# EAGLE design WRIST Sensors (EAGLE 9.6.2)
COMPANY: ADAFRUIT INDUSTRIES; DRAWN: KTOWN; REV: A
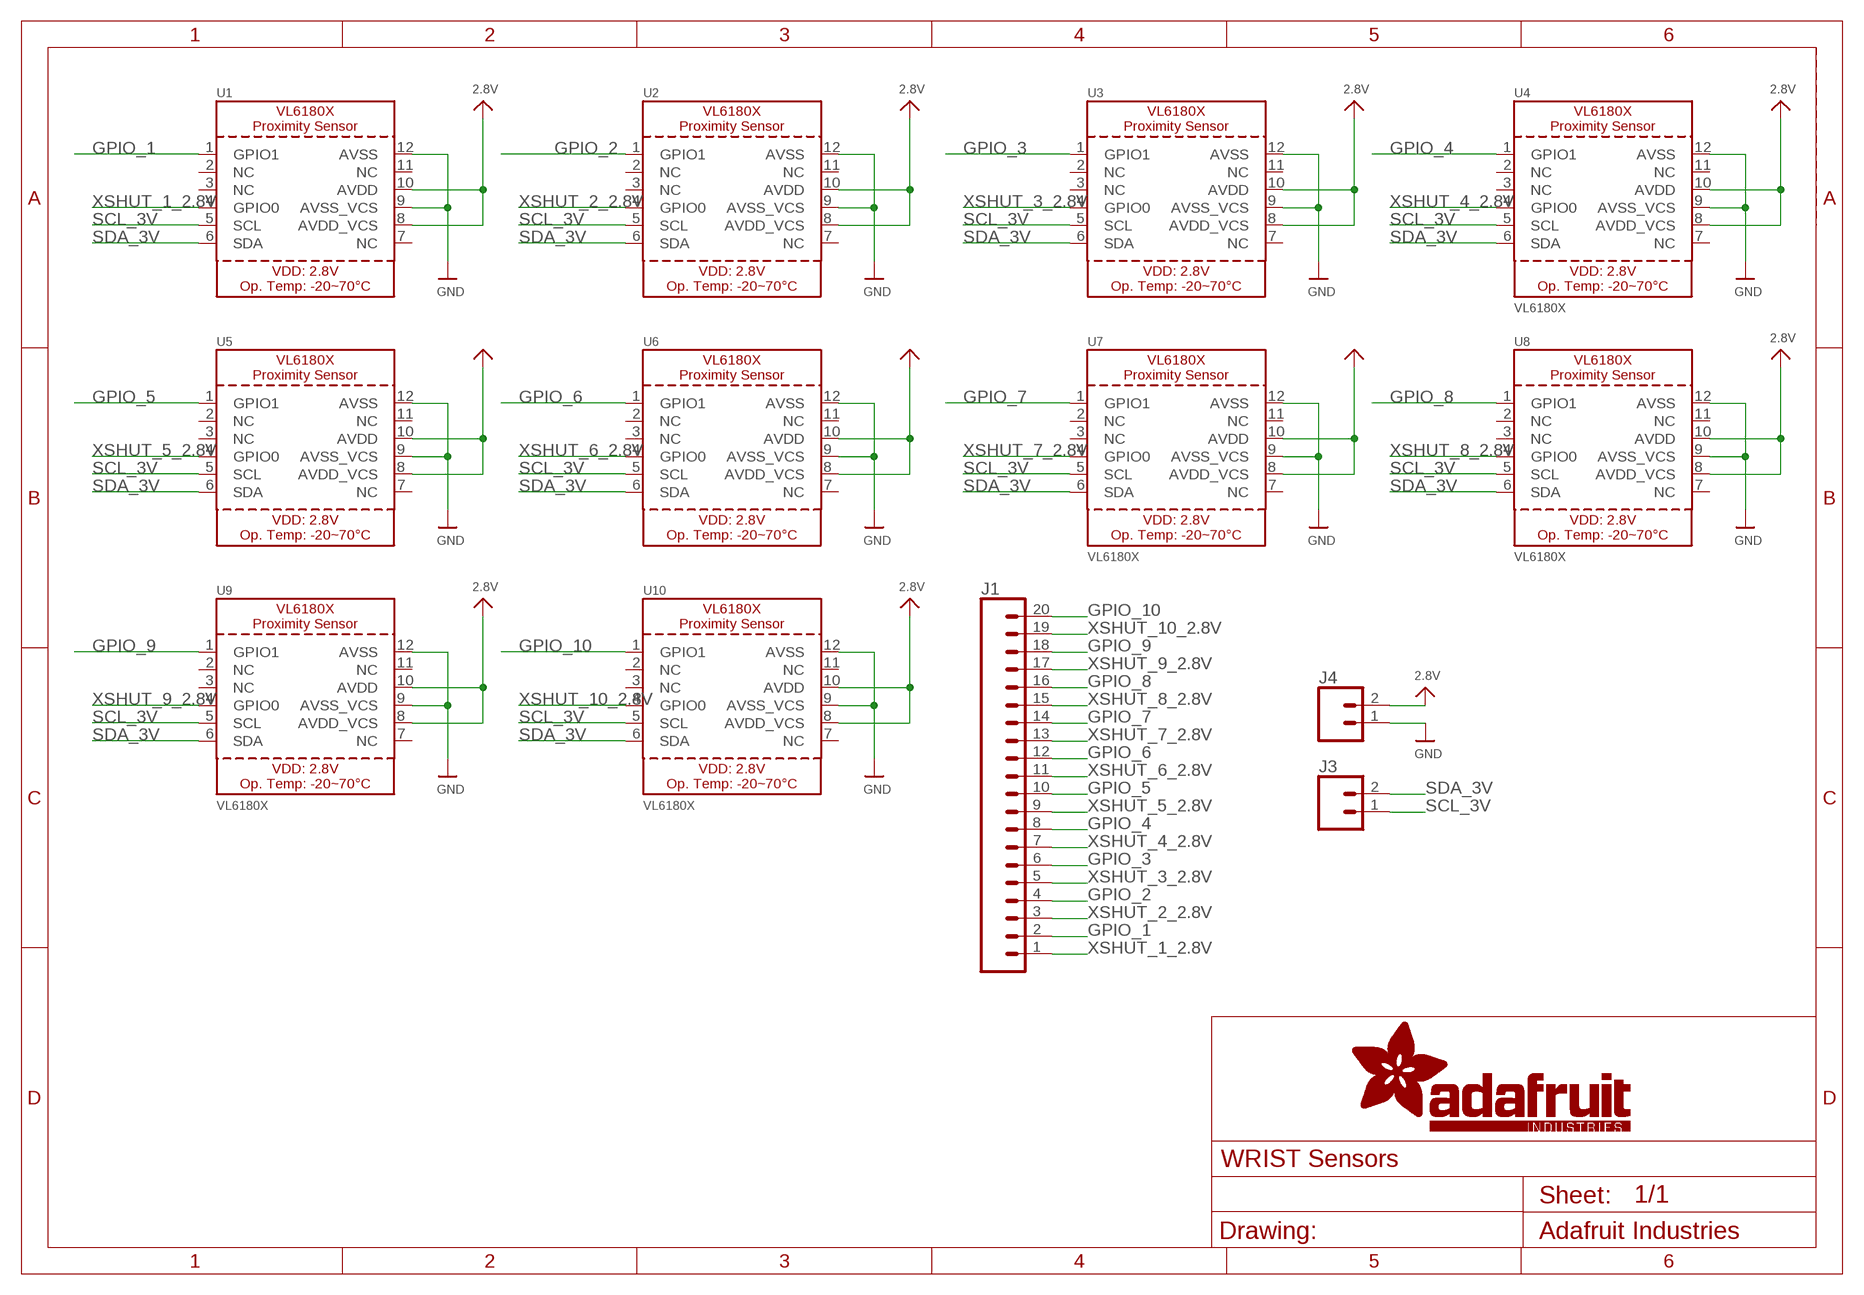
[diagram p0: schematic, sheet 1]

## Parts
J1  CONN_20NOSILK  [1X20_NOSILK]
J3  CONN_021X02_NO_SILK  [1X02_NO_SILK]
J4  CONN_021X02_NO_SILK  [1X02_NO_SILK]
U1  VL6180X  [VL6180]
U2  VL6180X  [VL6180]
U3  VL6180X  [VL6180]
U4  VL6180X  [VL6180]
U5  VL6180X  [VL6180]
U6  VL6180X  [VL6180]
U7  VL6180X  [VL6180]
U8  VL6180X  [VL6180]
U9  VL6180X  [VL6180]
U10  VL6180X  [VL6180]

## Nets
2.8V: J4.2 U1.8(AVDD_VCS) U1.10(AVDD) U2.8(AVDD_VCS) U2.10(AVDD) U3.8(AVDD_VCS) U3.10(AVDD) U4.8(AVDD_VCS) U4.10(AVDD) U5.8(AVDD_VCS) U5.10(AVDD) U6.8(AVDD_VCS) U6.10(AVDD) U7.8(AVDD_VCS) U7.10(AVDD) U8.8(AVDD_VCS) U8.10(AVDD) U9.8(AVDD_VCS) U9.10(AVDD) U10.8(AVDD_VCS) U10.10(AVDD)
GND: J4.1 U1.9(AVSS_VCS) U1.12(AVSS) U2.9(AVSS_VCS) U2.12(AVSS) U3.9(AVSS_VCS) U3.12(AVSS) U4.9(AVSS_VCS) U4.12(AVSS) U5.9(AVSS_VCS) U5.12(AVSS) U6.9(AVSS_VCS) U6.12(AVSS) U7.9(AVSS_VCS) U7.12(AVSS) U8.9(AVSS_VCS) U8.12(AVSS) U9.9(AVSS_VCS) U9.12(AVSS) U10.9(AVSS_VCS) U10.12(AVSS)
GPIO_1: J1.2 U1.1(GPIO1)
GPIO_2: J1.4 U2.1(GPIO1)
GPIO_3: J1.6 U3.1(GPIO1)
GPIO_4: J1.8 U4.1(GPIO1)
GPIO_5: J1.10 U5.1(GPIO1)
GPIO_6: J1.12 U6.1(GPIO1)
GPIO_7: J1.14 U7.1(GPIO1)
GPIO_8: J1.16 U8.1(GPIO1)
GPIO_9: J1.18 U9.1(GPIO1)
GPIO_10: J1.20 U10.1(GPIO1)
SCL_3V: J3.1 U1.5(SCL) U2.5(SCL) U3.5(SCL) U4.5(SCL) U5.5(SCL) U6.5(SCL) U7.5(SCL) U8.5(SCL) U9.5(SCL) U10.5(SCL)
SDA_3V: J3.2 U1.6(SDA) U2.6(SDA) U3.6(SDA) U4.6(SDA) U5.6(SDA) U6.6(SDA) U7.6(SDA) U8.6(SDA) U9.6(SDA) U10.6(SDA)
XSHUT_1_2.8V: J1.1 U1.4(GPIO0)
XSHUT_2_2.8V: J1.3 U2.4(GPIO0)
XSHUT_3_2.8V: J1.5 U3.4(GPIO0)
XSHUT_4_2.8V: J1.7 U4.4(GPIO0)
XSHUT_5_2.8V: J1.9 U5.4(GPIO0)
XSHUT_6_2.8V: J1.11 U6.4(GPIO0)
XSHUT_7_2.8V: J1.13 U7.4(GPIO0)
XSHUT_8_2.8V: J1.15 U8.4(GPIO0)
XSHUT_9_2.8V: J1.17 U9.4(GPIO0)
XSHUT_10_2.8V: J1.19 U10.4(GPIO0)
Unconnected: U1.2(NC) U1.3(NC) U1.7(NC) U1.11(NC) U2.2(NC) U2.3(NC) U2.7(NC) U2.11(NC) U3.2(NC) U3.3(NC) U3.7(NC) U3.11(NC) U4.2(NC) U4.3(NC) U4.7(NC) U4.11(NC) U5.2(NC) U5.3(NC) U5.7(NC) U5.11(NC) U6.2(NC) U6.3(NC) U6.7(NC) U6.11(NC) U7.2(NC) U7.3(NC) U7.7(NC) U7.11(NC) U8.2(NC) U8.3(NC) U8.7(NC) U8.11(NC) U9.2(NC) U9.3(NC) U9.7(NC) U9.11(NC) U10.2(NC) U10.3(NC) U10.7(NC) U10.11(NC)

## Library data of the parts
J1 = SparkFun-Connectors:CONN_20: Multi connection point. Often used as Generic Header-pin footprint for 0.1 inch spaced/style header connections On any of the 0.1 inch spaced packages, you can populate with these: Break Away Headers - Straight <https://www.sparkfun.com/products/116> (PRT-00116) Break Away Male Headers - Right Angle <https://www.sparkfun.com/products/553> (PRT-00553) Female Headers <https://www.sparkfun.com/products/115> (PRT-00115) Break Away Headers - Machine Pin <https://www.sparkfun.com/products/117> (PRT-00117) Break Away Female Headers - Swiss Machine Pin <https://www.sparkfun.com/products/743> (PRT-00743) For SCREWTERMINALS and SPRING TERMINALS visit here: Screw Terimnals on SparkFun.com <https://www.sparkfun.com/search/results?term=Screw+Terminals> (5mm/3.5mm/2.54mm spacing) This device is also useful as a general connection point to wire up your design to another part of your project. Our various solder wires solder well into these plated through hole pads. Hook-Up Wire - Assortment (Stranded, 22 AWG) <https://www.sparkfun.com/products/11375> (PRT-11375) Hook-Up Wire - Assortment (Solid Core, 22 AWG) <https://www.sparkfun.com/products/11367> (PRT-11367) View the entire wire category on our website here <https://www.sparkfun.com/categories/141> Special notes: Molex polarized connector foot print use with SKU : PRT-08231 with associated crimp pins and housings. 1MM SMD Version SKU: PRT-10208 NOTES ON THE VARIANTS LOCK and LOCK_LONGPADS... This footprint was designed to help hold the alignment of a through-hole component (i.e. 6-pin header) while soldering it into place. You may notice that each hole has been shifted either up or down by 0.005 of an inch from it's more standard position (which is a perfectly straight line). This slight alteration caused the pins (the squares in the middle) to touch the edges of the holes. Because they are alternating, it causes a "brace" to hold the component in place. 0.005 has proven to be the perfect amount of "off-center" position when using our standard breakaway headers. Although looks a little odd when you look at the bare footprint, once you have a header in there, the alteration is very hard to notice. Also,if you push a header all the way into place, it is covered up entirely on the bottom side. Note about LOCK SPECIAL package: This is just like the LOCK variant in that the holes are staggared by 5 mil, but except for the last two holes. They are not altered from the "standard" footprint layout. This is used for a special purpose on the layout of our Graphic LCD Backpack. Make sure you want to use this device before selecting it for you project!
J3 J4 = SparkFun-Connectors:CONN_02: Multi connection point. Often used as Generic Header-pin footprint for 0.1 inch spaced/style header connections On any of the 0.1 inch spaced packages, you can populate with these: Break Away Headers - Straight <https://www.sparkfun.com/products/116> (PRT-00116) Break Away Male Headers - Right Angle <https://www.sparkfun.com/products/553> (PRT-00553) Female Headers <https://www.sparkfun.com/products/115> (PRT-00115) Break Away Headers - Machine Pin <https://www.sparkfun.com/products/117> (PRT-00117) Break Away Female Headers - Swiss Machine Pin <https://www.sparkfun.com/products/743> (PRT-00743) For SCREWTERMINALS and SPRING TERMINALS visit here: Screw Terimnals on SparkFun.com <https://www.sparkfun.com/search/results?term=Screw+Terminals> (5mm/3.5mm/2.54mm spacing) This device is also useful as a general connection point to wire up your design to another part of your project. Our various solder wires solder well into these plated through hole pads. Hook-Up Wire - Assortment (Stranded, 22 AWG) <https://www.sparkfun.com/products/11375> (PRT-11375) Hook-Up Wire - Assortment (Solid Core, 22 AWG) <https://www.sparkfun.com/products/11367> (PRT-11367) View the entire wire category on our website here <https://www.sparkfun.com/categories/141> Special notes: Molex polarized connector foot print use with: PRT-08233 with associated crimp pins and housings. 2.54_SCREWTERM for use with PRT-10571. 3.5mm Screw Terminal footprints for PRT-08084 5mm Screw Terminal footprints for use with PRT-08432
U1-U10 = microbuilder:VL6180X: VL6180x Proximity and Light Sensor with Gesture Recognition Supply Level: 2.8V (3.0V Max!) Range: 0-10cm Light Sensor: 0..100K Lux (16-bit output) IR emitter: 850 nm I2C Address: 0x29 (7-bit)

## Net classes
1 highpower: width 0.406 mm, drill 0.483 mm
2 lowpower: width 0.305 mm, drill 0.483 mm

## Board
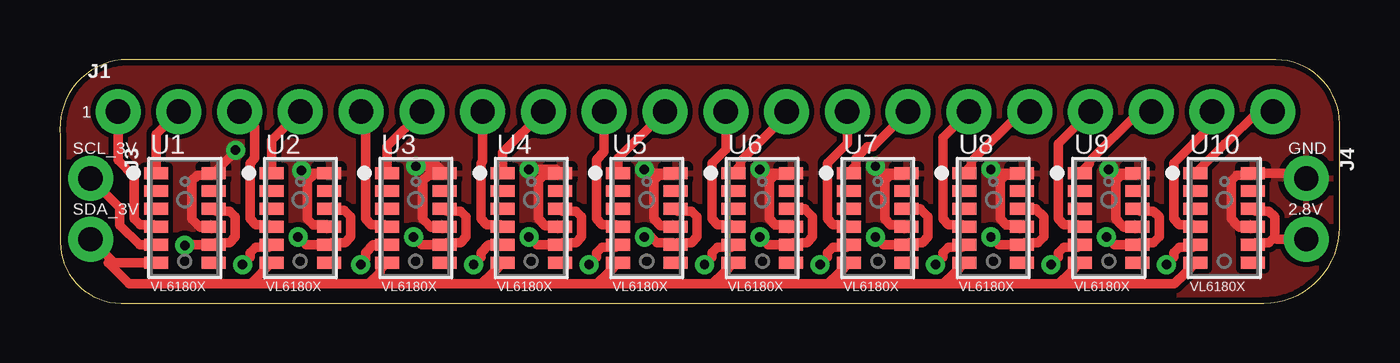
[diagram p1: board, top side]
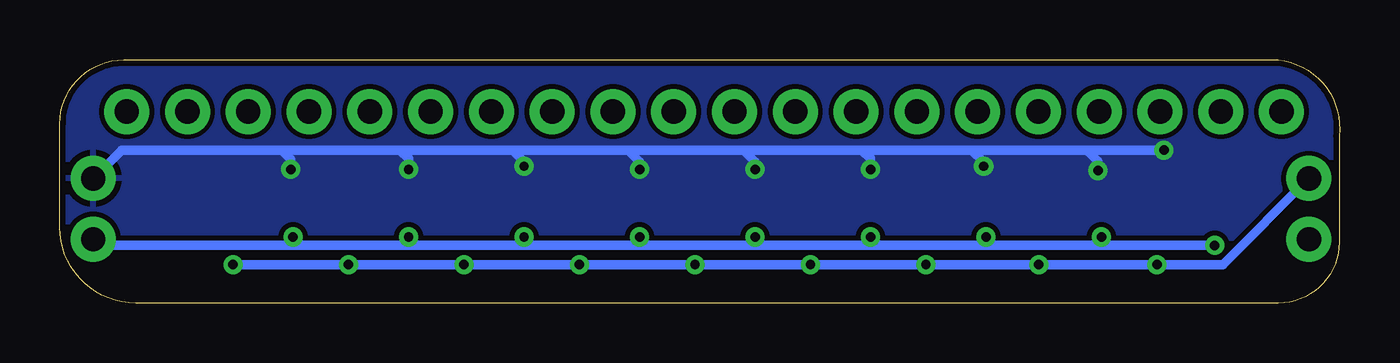
[diagram p2: board, bottom side, seen from below]

Size 53.48 x 10.16 mm. Coordinates in mm from the lower left corner, seen from the top.
Outline: 0.02,6.99 0.02,2.54 arc90 2.56,0 50.31,0 arc90 53.48,3.17 53.48,7.49 arc90 50.82,10.16 2.56,10.16 arc90 0.02,6.99
Copper layers (1*16): Top 0.035mm / dielectric 1.5mm / Bottom 0.035mm
Design rules "adafruit *": minimum track width 8mil, minimum drill 15.5mil, track to track 8mil, track to pad 8mil, pad to pad 8mil, via to via 8mil, smd to smd 8mil, copper to edge 10mil, drill to drill 8mil, minimum pad ring 10mil, minimum via ring 8mil, stop-mask expansion 2mil, vias tented up to drill 20mil, thermal gap 10mil

### Footprints (pad centres in the part's own frame; a part is rotated, then mirrored left to right if it is on the bottom)
1X20_NOSILK = drill 1.016 pad 1.88: 1 0,0; 2 2.54,0; 3 5.08,0; 4 7.62,0; 5 10.16,0; 6 12.7,0; 7 15.24,0; 8 17.78,0; 9 20.32,0; 10 22.86,0; 11 25.4,0; 12 27.94,0; 13 30.48,0; 14 33.02,0; 15 35.56,0; 16 38.1,0; 17 40.64,0; 18 43.18,0; 19 45.72,0; 20 48.26,0
1X02_NO_SILK = drill 1.016 pad 1.88: 1 0,0; 2 2.54,0
VL6180 = smd 1 x 0.5: 1 -1.2,1.875; 2 -1.2,1.125; 3 -1.2,0.375; 4 -1.2,-0.375; 5 -1.2,-1.125; 6 -1.2,-1.875; 7 1.2,-1.875; 8 1.2,-1.125; 9 1.2,-0.375; 10 1.2,0.375; 11 1.2,1.125; 12 1.2,1.875

### Placement (x,y rotation side)
J1  2.43,8 0 top
J3  1.29,5.21 270 top
J4  52.09,5.21 270 top
U1  5.22,3.56 0 top
U2  10.05,3.56 0 top
U3  14.88,3.56 0 top
U4  19.7,3.56 0 top
U5  24.53,3.56 0 top
U6  29.35,3.56 0 top
U7  34.18,3.56 0 top
U8  39.01,3.56 0 top
U9  43.83,3.56 0 top
U10  48.66,3.56 0 top

### Tracks (layer width: path | path; a pad name or v marks a point on that pad's centre or on a via)
2.8V  (via drill 0.39)
  Top 0.406: U1.10 6.52,3.84 7.09,3.84 7.33,3.6 7.33,2.76 7.09,2.52 6.52,2.52 U1.8 5.24,2.43 v5.22,2.41 | U2.10 11.3,3.88 11.87,3.88 12.16,3.6 12.16,2.76 11.92,2.52 11.34,2.52 U2.8 10.29,2.43 v9.95,2.76 | U3.10 16.17,3.84 16.74,3.84 16.98,3.6 16.98,2.76 16.74,2.52 16.17,2.52 U3.8 15.11,2.43 v14.78,2.76 | U4.10 21,3.84 21.57,3.84 21.81,3.6 21.81,2.76 21.57,2.52 21,2.52 U4.8 19.94,2.43 v19.61,2.76 | U5.10 25.82,3.84 26.4,3.84 26.63,3.6 26.63,2.76 26.4,2.52 25.82,2.52 U5.8 25.63,2.52 24.95,2.52 24.71,2.76 v24.43,2.76 | U6.10 31.13,3.94 31.13,3.93 31.46,3.6 31.46,2.76 31.22,2.52 30.65,2.52 U6.8 29.59,2.43 v29.26,2.76 | U7.10 35.96,3.94 35.96,3.93 36.29,3.6 36.29,2.76 36.05,2.52 35.47,2.52 U7.8 34.42,2.43 v34.08,2.76 | U8.10 40.78,3.94 40.78,3.93 41.11,3.6 41.11,2.76 40.87,2.52 40.3,2.52 U8.8 39.24,2.43 v38.91,2.76 | U9.10 45.13,3.84 45.7,3.84 45.94,3.6 45.94,2.76 45.7,2.52 45.13,2.52 U9.8 44.07,2.43 v43.74,2.76 | 50.76,2.76 50.76,3.6 50.53,3.84 49.95,3.84 U10.10 | U10.8 49.95,2.52 50.53,2.52 50.76,2.76 | 50.76,2.76 50.86,2.67 J4.2
  Bottom 0.406: v5.22,2.41 10.3,2.41 | J4.2 51.83,2.41 43.39,2.41 | 10.3,2.41 14.43,2.41 | 14.43,2.41 19.26,2.41 | 19.26,2.41 24.08,2.41 | 24.08,2.41 28.91,2.41 | 28.91,2.41 33.73,2.41 | 33.73,2.41 38.56,2.41 | 43.39,2.41 38.56,2.41 | v9.95,2.76 10.3,2.41 | v29.26,2.76 28.91,2.41 | v14.78,2.76 14.43,2.41 | v19.61,2.76 19.26,2.41 | v24.43,2.76 24.08,2.41 | v34.08,2.76 33.73,2.41 | v38.91,2.76 38.56,2.41 | v43.74,2.76 43.39,2.41
GND  (via drill 0.39)
  Top 0.406: U1.9 5.86,3.17 5.76,3.27 5.52,3.51 5.52,5.1 5.76,5.34 6.33,5.34 U1.12 7.34,6.35 v7.34,6.39 | U2.9 11.16,3.27 10.58,3.27 10.34,3.51 10.34,5.1 10.68,5.43 U2.12 10.21,5.43 v10.1,5.54 | U3.9 15.51,3.17 15.41,3.27 15.17,3.51 15.17,5.1 15.41,5.34 15.98,5.34 U3.12 15.79,5.71 v14.88,5.71 | v19.61,5.59 20.75,5.59 U4.12 20.81,5.34 20.23,5.34 20,5.1 20,3.51 20.28,3.23 20.86,3.23 U4.9 | U5.9 25.68,3.23 25.11,3.23 24.82,3.51 24.82,5.1 25.06,5.34 25.63,5.34 U5.12 24.59,5.43 v24.43,5.59 | U6.9 30.46,3.27 29.89,3.27 29.65,3.51 29.65,5.1 29.89,5.34 30.46,5.34 U6.12 29.41,5.43 v29.26,5.59 | U7.9 35.29,3.27 34.71,3.27 34.47,3.51 34.47,5.1 34.71,5.34 35.29,5.34 U7.12 34.37,5.43 v34.08,5.71 | U8.9 40.11,3.27 39.54,3.27 39.3,3.51 39.3,5.1 39.54,5.34 40.11,5.34 U8.12 39.07,5.43 v38.91,5.59 | U9.9 44.47,3.17 44.37,3.27 44.36,3.27 44.13,3.51 44.13,5.1 44.36,5.34 44.94,5.34 U9.12 43.99,5.43 v43.83,5.59 | U10.9 49.29,3.17 49.19,3.27 48.95,3.51 48.95,5.1 49.19,5.34 49.76,5.34 U10.12 51.86,5.43 51.99,5.3 | 51.99,5.3 | 51.99,5.3 J4.1
  Bottom 0.406: v7.34,6.39 10.56,6.39 | 10.56,6.39 15.38,6.39 | J4.1 50.9,6.39 44.21,6.39 | 44.21,6.39 39.26,6.39 | 29.74,6.39 34.56,6.39 | 29.74,6.39 24.91,6.39 | 24.91,6.39 19.96,6.39 | 19.96,6.39 15.38,6.39 | v10.1,5.54 10.1,5.93 10.56,6.39 | v14.88,5.71 14.88,5.88 15.38,6.39 | v24.43,5.59 24.43,5.91 24.91,6.39 | v29.26,5.59 29.26,5.91 29.74,6.39 | v34.08,5.71 34.08,5.91 34.56,6.39 | v19.61,5.59 19.61,6.04 19.96,6.39 | v38.91,5.59 38.91,6.04 39.26,6.39 | v43.83,5.59 43.83,6.01 44.21,6.39 | 34.56,6.39 39.26,6.39
  pour Top: 0.02,10.16 53.48,10.16 53.48,0 0.02,0
  pour Bottom: 0.02,10.16 53.48,10.16 53.48,0 0.02,0
GPIO_1
  Top 0.406: U1.1 4.02,7.05 J1.2
GPIO_2
  Top 0.406: U2.1 8.85,6.8 J1.4
GPIO_3
  Top 0.406: U3.1 13.68,6.55 J1.6
GPIO_4
  Top 0.406: U4.1 18.5,6.29 J1.8
GPIO_5
  Top 0.406: U5.1 23.33,6.04 J1.10
GPIO_6
  Top 0.406: U6.1 28.45,5.73 28.45,5.92 30.37,7.84 J1.12
GPIO_7
  Top 0.406: U7.1 33.28,5.73 33.28,6.05 33.75,6.52 33.97,6.52 J1.14
GPIO_8
  Top 0.406: U8.1 38.1,5.73 38.1,5.92 40.18,8 J1.16
GPIO_9
  Top 0.406: U9.1 43.03,5.83 43.03,5.92 45.11,8 J1.18
GPIO_10
  Top 0.406: U10.1 48.68,6.66 48.71,6.66 50.05,8 J1.20
SCL_3V  (via drill 0.39)
  Top 0.406: U2.5 8.76,2.34 8.18,2.34 7.94,2.1 7.94,1.91 v7.64,1.61 | v12.57,1.61 12.77,1.8 12.77,2.1 13.1,2.43 U3.5 | J3.1 2.51,3.99 2.51,3.26 3.34,2.43 U1.5 | v17.29,1.61 17.6,1.91 17.6,2.1 17.93,2.43 U4.5 | U5.5 23.23,2.34 22.66,2.34 22.42,2.1 22.42,1.91 v22.12,1.61 | U6.5 28.06,2.34 27.49,2.34 27.25,2.1 27.25,1.91 v26.94,1.61 | U7.5 32.89,2.34 32.31,2.34 32.07,2.1 32.07,1.91 v31.77,1.61 | U8.5 37.71,2.34 37.14,2.34 36.9,2.1 36.9,1.91 v36.59,1.61 | U9.5 42.54,2.34 41.96,2.34 41.73,2.1 41.73,1.91 v41.42,1.61 | U10.5 47.36,2.34 46.79,2.34 46.55,2.1 46.55,1.91 v46.25,1.61
  Bottom 0.406: J3.1 4.89,1.61 v7.64,1.61 v12.57,1.61 v17.29,1.61 v22.12,1.61 v26.94,1.61 v31.77,1.61 v36.59,1.61 v41.42,1.61 v46.25,1.61
SDA_3V
  Top 0.406: 2.27,1.68 2.02,1.68 2.9,0.8 7.97,0.8 | 2.27,1.68 U1.6 | 2.27,1.68 J3.2 | 7.97,0.8 8.44,1.27 U2.6 | 12.91,0.8 13.38,1.27 13.38,1.38 U3.6 | 12.91,0.8 7.97,0.8 | 17.62,0.8 18.1,1.27 U4.6 | 17.62,0.8 12.91,0.8 | 22.45,0.8 22.92,1.27 U5.6 | 22.45,0.8 17.62,0.8 | 27.28,0.8 27.75,1.27 U6.6 | 27.28,0.8 22.45,0.8 | 32.1,0.8 32.57,1.27 U7.6 | 32.1,0.8 27.28,0.8 | U8.6 37.4,1.27 36.93,0.8 | 36.93,0.8 32.1,0.8 | 41.75,0.8 42.23,1.27 U9.6 | 41.75,0.8 36.93,0.8 | U10.6 47.05,1.27 46.58,0.8 41.75,0.8
XSHUT_1_2.8V
  Top 0.406: U1.4 3.93,3.27 3.36,3.27 3.12,3.51 3.12,5.28 2.43,5.97 J1.1
XSHUT_2_2.8V
  Top 0.406: U2.4 8.76,3.27 8.18,3.27 7.94,3.51 7.94,5.85 8.15,6.06 8.15,7.36 J1.3
XSHUT_3_2.8V
  Top 0.406: U3.4 13.58,3.27 13.01,3.27 12.77,3.51 12.77,7.82 J1.5
XSHUT_4_2.8V
  Top 0.406: U4.4 18.41,3.27 17.83,3.27 17.6,3.51 17.6,5.85 17.67,5.92 J1.7
XSHUT_5_2.8V
  Top 0.406: U5.4 23.23,3.27 22.66,3.27 22.42,3.51 22.42,6 22.75,6.32 J1.9
XSHUT_6_2.8V
  Top 0.406: U6.4 28.06,3.27 27.49,3.27 27.25,3.51 27.25,5.85 27.83,6.43 J1.11
XSHUT_7_2.8V
  Top 0.406: U7.4 32.89,3.27 32.31,3.27 32.07,3.51 32.07,5.85 32.91,6.69 J1.13
XSHUT_8_2.8V
  Top 0.406: U8.4 37.71,3.27 37.14,3.27 36.9,3.51 36.9,6.91 J1.15
XSHUT_9_2.8V
  Top 0.406: U9.4 42.54,3.27 41.96,3.27 41.73,3.51 41.73,6.66 J1.17
XSHUT_10_2.8V
  Top 0.406: U10.4 47.36,3.27 46.79,3.27 46.55,3.51 46.55,5.85 48.15,7.45 J1.19

### Text on the board
tPlace: 1 | SCL_3V | GND | SDA_3V | 2.8V